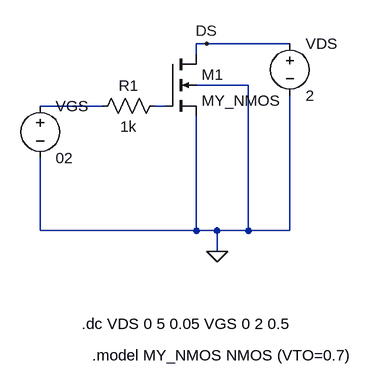
[diagram p0: schematic nmos_iv_output.asc]
nmos_iv_output.asc, the LTspice schematic file:
Version 4.1
SHEET 1 880 680
WIRE 304 112 288 112
WIRE 432 112 304 112
WIRE 288 128 288 112
WIRE 368 176 288 176
WIRE 144 208 48 208
WIRE 240 208 224 208
WIRE 48 400 48 288
WIRE 288 400 288 224
WIRE 288 400 48 400
WIRE 320 400 288 400
WIRE 368 400 368 176
WIRE 368 400 320 400
WIRE 432 400 432 192
WIRE 432 400 368 400
WIRE 320 432 320 400
FLAG 304 112 DS
FLAG 320 432 0
SYMBOL voltage 48 192 R0
WINDOW 123 0 0 Left 0
WINDOW 39 0 0 Left 0
SYMATTR InstName VGS
SYMATTR Value 02
SYMBOL voltage 432 96 R0
WINDOW 123 0 0 Left 0
WINDOW 39 0 0 Left 0
SYMATTR InstName VDS
SYMATTR Value 2
SYMBOL res 240 192 R90
WINDOW 0 0 56 VBottom 2
WINDOW 3 32 56 VTop 2
SYMATTR InstName R1
SYMATTR Value 1k
SYMBOL nmos4 240 128 R0
SYMATTR InstName M1
SYMATTR Value MY_NMOS
TEXT 112 544 Left 2 !.dc VDS 0 5 0.05 VGS 0 2 0.5
TEXT 128 592 Left 2 !.model MY_NMOS NMOS (VTO=0.7)

The netlist it stands for:
* nmos_iv_output.asc
VGS N001 0 02
VDS DS 0 2
R1 N002 N001 1k
M1 DS N002 0 0 MY_NMOS
.model NMOS NMOS
.model PMOS PMOS
.lib standard.mos
.dc VDS 0 5 0.05 VGS 0 2 0.5
.model MY_NMOS NMOS (VTO=0.7)
.backanno
.end